# EAGLE design kombi_8relais02 (EAGLE 4.16)
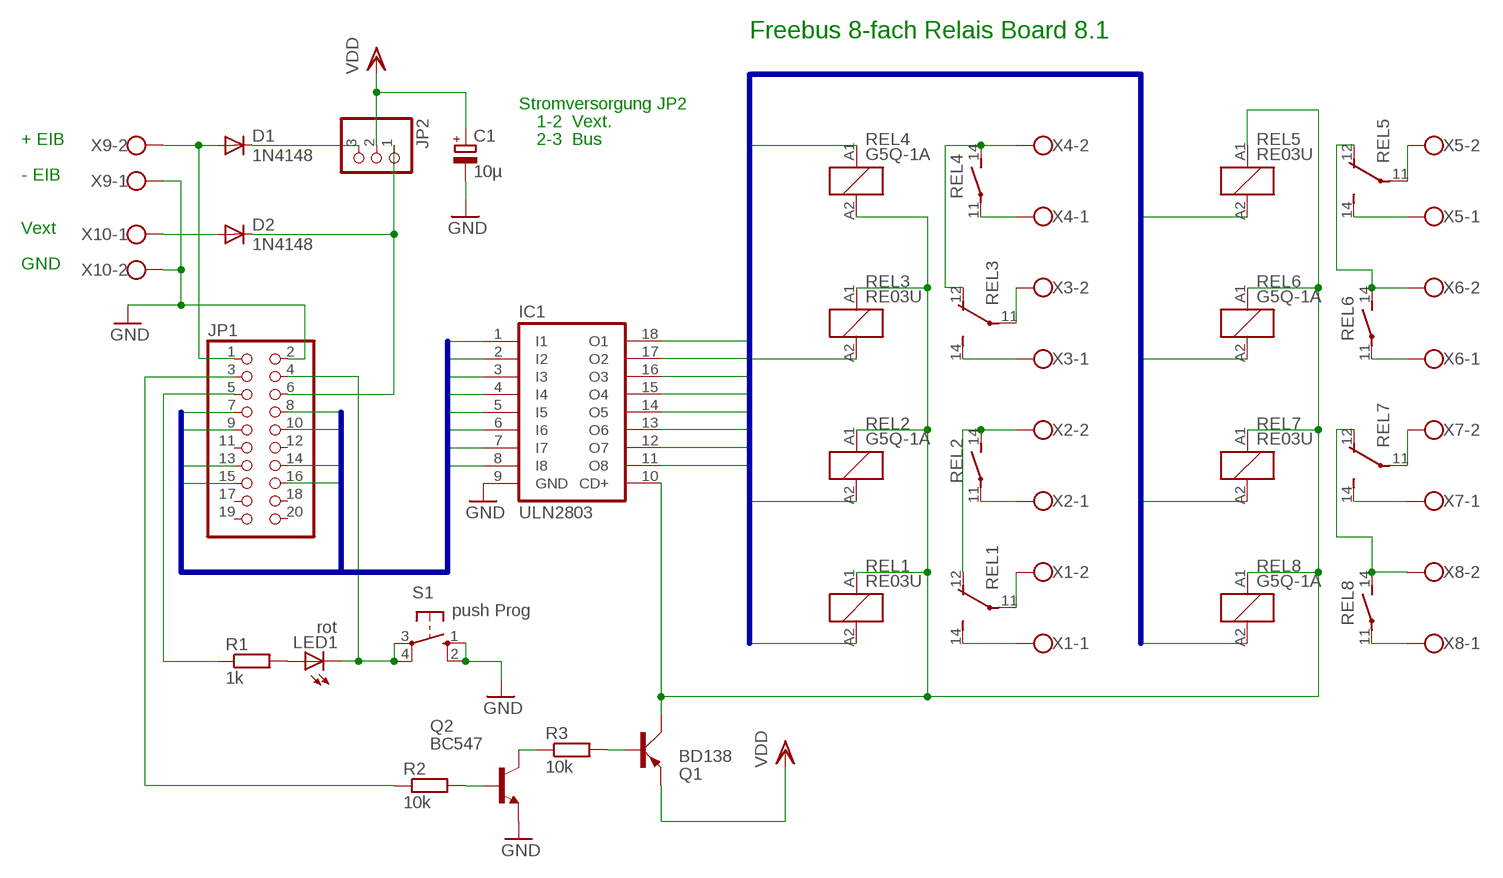
[diagram p0: schematic, sheet 1]

## Parts
C1  10µ  CPOL-EUE3.5-8  [E3,5-8]
D1  1N4148  [DO35-10]
D2  1N4148  [DO35-10]
IC1  ULN2803  ULN2803A  [DIL18]
JP1  PINHD-2X10  [2X10]
JP2  PINHD-1X3  [1X03]
LED1  rot  LED3MM  [LED3MM]
Q1  BD138  BD140  [TO126AV]
Q2  BC547  [TO92]
R1  1k  R-EU_0207/10  [0207/10]
R2  10k  R-EU_0207/10  [0207/10]
R3  10k  R-EU_0207/10  [0207/10]
REL1  RE03U  [G5Q_1_EU]
REL2  G5Q-1A  RE030024  [RE-SCHRACK]
REL3  RE03U  [G5Q_1_EU]
REL4  G5Q-1A  RE030024  [RE-SCHRACK]
REL5  RE03U  [G5Q_1_EU]
REL6  G5Q-1A  RE030024  [RE-SCHRACK]
REL7  RE03U  [G5Q_1_EU]
REL8  G5Q-1A  RE030024  [RE-SCHRACK]
S1  push Prog  10-XX  [B3F-10XX]
X1  W237-102  [W237-102]
X2  W237-102  [W237-102]
X3  W237-102  [W237-102]
X4  W237-102  [W237-102]
X5  W237-102  [W237-102]
X6  W237-102  [W237-102]
X7  W237-102  [W237-102]
X8  W237-102  [W237-102]
X9  W237-102  [W237-102]
X10  W237-102  [W237-102]

## Nets
GND: C1.- IC1.9(GND) JP1.2 Q2.1(E) S1.1(S) S1.2(S1) X9.1 X10.2
IO1: IC1.1(I1) JP1.16
IO2: IC1.2(I2) JP1.15
IO3: IC1.3(I3) JP1.14
IO4: IC1.4(I4) JP1.13
IO5: IC1.5(I5) JP1.10
IO6: IC1.6(I6) JP1.9
IO7: IC1.7(I7) JP1.8
IO8: IC1.8(I8) JP1.7
N$1: REL4.11(2:P) X4.1
N$2: REL3.12(14:O) REL4.14(2:S) X4.2
N$3: REL3.14(14:S) X3.1
N$4: REL3.11(14:P) X3.2
N$5: REL2.11(2:P) X2.1
N$6: REL1.12(14:O) REL2.14(2:S) X2.2
N$7: REL1.14(14:S) X1.1
N$8: REL1.11(14:P) X1.2
N$9: REL5.12(14:O) REL6.14(2:S) X6.2
N$10: REL6.11(2:P) X6.1
N$11: REL7.11(14:P) X7.2
N$12: REL8.11(2:P) X8.1
N$13: REL5.11(14:P) X5.2
N$14: REL5.14(14:S) X5.1
N$15: REL7.14(14:S) X7.1
N$16: REL7.12(14:O) REL8.14(2:S) X8.2
N$17: D2.A X10.1
N$19: IC1.10(CD+) Q1.C REL1.A1 REL2.A1 REL3.A1 REL4.A2 REL5.A1 REL6.A1 REL7.A1 REL8.A1
N$20: D1.A JP1.1 X9.2
N$24: JP1.5 R1.1
N$27: JP1.4 LED1.K(C) S1.3(P) S1.4(P1)
N$28: LED1.A R1.2
N$31: D2.C JP1.6 JP2.1
N$32: D1.C JP2.3
N$33: JP1.3 R2.1
N$37: Q1.B R3.2
N$38: Q2.3(C) R3.1
N$39: Q2.2(B) R2.2
R1: IC1.14(O5) REL4.A1
R2: IC1.13(O6) REL3.A2
R3: IC1.12(O7) REL2.A2
R4: IC1.11(O8) REL1.A2
R5: IC1.15(O4) REL5.A2
R6: IC1.16(O3) REL6.A2
R7: IC1.17(O2) REL7.A2
R8: IC1.18(O1) REL8.A2
VDD: C1.+ JP2.2 Q1.E
Unconnected: JP1.11 JP1.12 JP1.17 JP1.18 JP1.19 JP1.20

## Buses
R[1..8]
IO[1..8]

## Notes on the sheet
- Freebus 8-fach Relais Board 8.1
- Stromversorgung JP2
- 1-2  Vext.
- + EIB | 2-3  Bus
- - EIB
- Vext
- GND

## Library data of the parts
C1 = rcl:CPOL-EU: POLARIZED CAPACITOR, European symbol
D1 D2 = diode:1N4148: DIODE high speed (Philips)
IC1 = uln-udn:ULN2803A: DRIVER ARRAY
JP1 = pinhead:PINHD-2X10: PIN HEADER
JP2 = pinhead:PINHD-1X3: PIN HEADER
LED1 = led:LED: LED OSRAM: - CHIPLED LG R971, LG N971, LY N971, LG Q971, LY Q971, LO R971, LY R971 LH N974, LH R974 LS Q976, LO Q976, LY Q976 LO Q996 - Hyper CHIPLED LW Q18S LB Q993, LB Q99A, LB R99A - SideLED LS A670, LO A670, LY A670, LG A670, LP A670 LB A673, LV A673, LT A673, LW A673 LH A674 LY A675 LS A676, LA A676, LO A676, LY A676, LW A676 LS A679, LY A679, LG A679 - Hyper Micro SIDELED® LS Y876, LA Y876, LO Y876, LY Y876 LT Y87S - SmartLED LW L88C, LW L88S LB L89C, LB L89S, LG L890 LS L89K, LO L89K, LY L89K LS L896, LA L896, LO L896, LY L896 - TOPLED LS T670, LO T670, LY T670, LG T670, LP T670 LSG T670, LSP T670, LSY T670, LOP T670, LYG T670 LG T671, LOG T671, LSG T671 LB T673, LV T673, LT T673, LW T673 LH T674 LS T676, LA T676, LO T676, LY T676, LB T676, LH T676, LSB T676, LW T676 LB T67C, LV T67C, LT T67C, LS T67K, LO T67K, LY T67K, LW E67C LS E67B, LA E67B, LO E67B, LY E67B, LB E67C, LV E67C, LT E67C LW T67C LS T679, LY T679, LG T679 LS T770, LO T770, LY T770, LG T770, LP T770 LB T773, LV T773, LT T773, LW T773 LH T774 LS E675, LA E675, LY E675, LS T675 LS T776, LA T776, LO T776, LY T776, LB T776 LHGB T686 LT T68C, LB T68C - Hyper Mini TOPLED® LB M676 - Mini TOPLED Santana® LG M470 LS M47K, LO M47K, LY M47K Source: http://www.osram.convergy.de - LUMILED® LXK2-PW12-R00, LXK2-PW12-S00, LXK2-PW14-U00, LXK2-PW14-V00 LXK2-PM12-R00, LXK2-PM12-S00, LXK2-PM14-U00 LXK2-PE12-Q00, LXK2-PE12-R00, LXK2-PE12-S00, LXK2-PE14-T00, LXK2-PE14-U00 LXK2-PB12-K00, LXK2-PB12-L00, LXK2-PB12-M00, LXK2-PB14-N00, LXK2-PB14-P00, LXK2-PB14-Q00 LXK2-PR12-L00, LXK2-PR12-M00, LXK2-PR14-Q00, LXK2-PR14-R00 LXK2-PD12-Q00, LXK2-PD12-R00, LXK2-PD12-S00 LXK2-PH12-R00, LXK2-PH12-S00 LXK2-PL12-P00, LXK2-PL12-Q00, LXK2-PL12-R00 Source: www.luxeon.com
Q1 = transistor-power:BD140: PNP TRANSISTOR
Q2 = transistor-npn:BC547*: NPN Transistor
R1-R3 = rcl:R-EU_: RESISTOR, European symbol
REL1 REL3 REL5 REL7 = freebus_relay:RE03U
REL2 REL4 REL6 REL8 = relay:RE03*: Miniature PCB Relay 1 pole 6 A SCHRACK Source: http://www.schrack.com/.. 5812.pdf
S1 = switch-omron:10-XX: OMRON SWITCH
X1-X10 = con-wago-500:W237-102: WAGO SCREW CLAMP

## Board
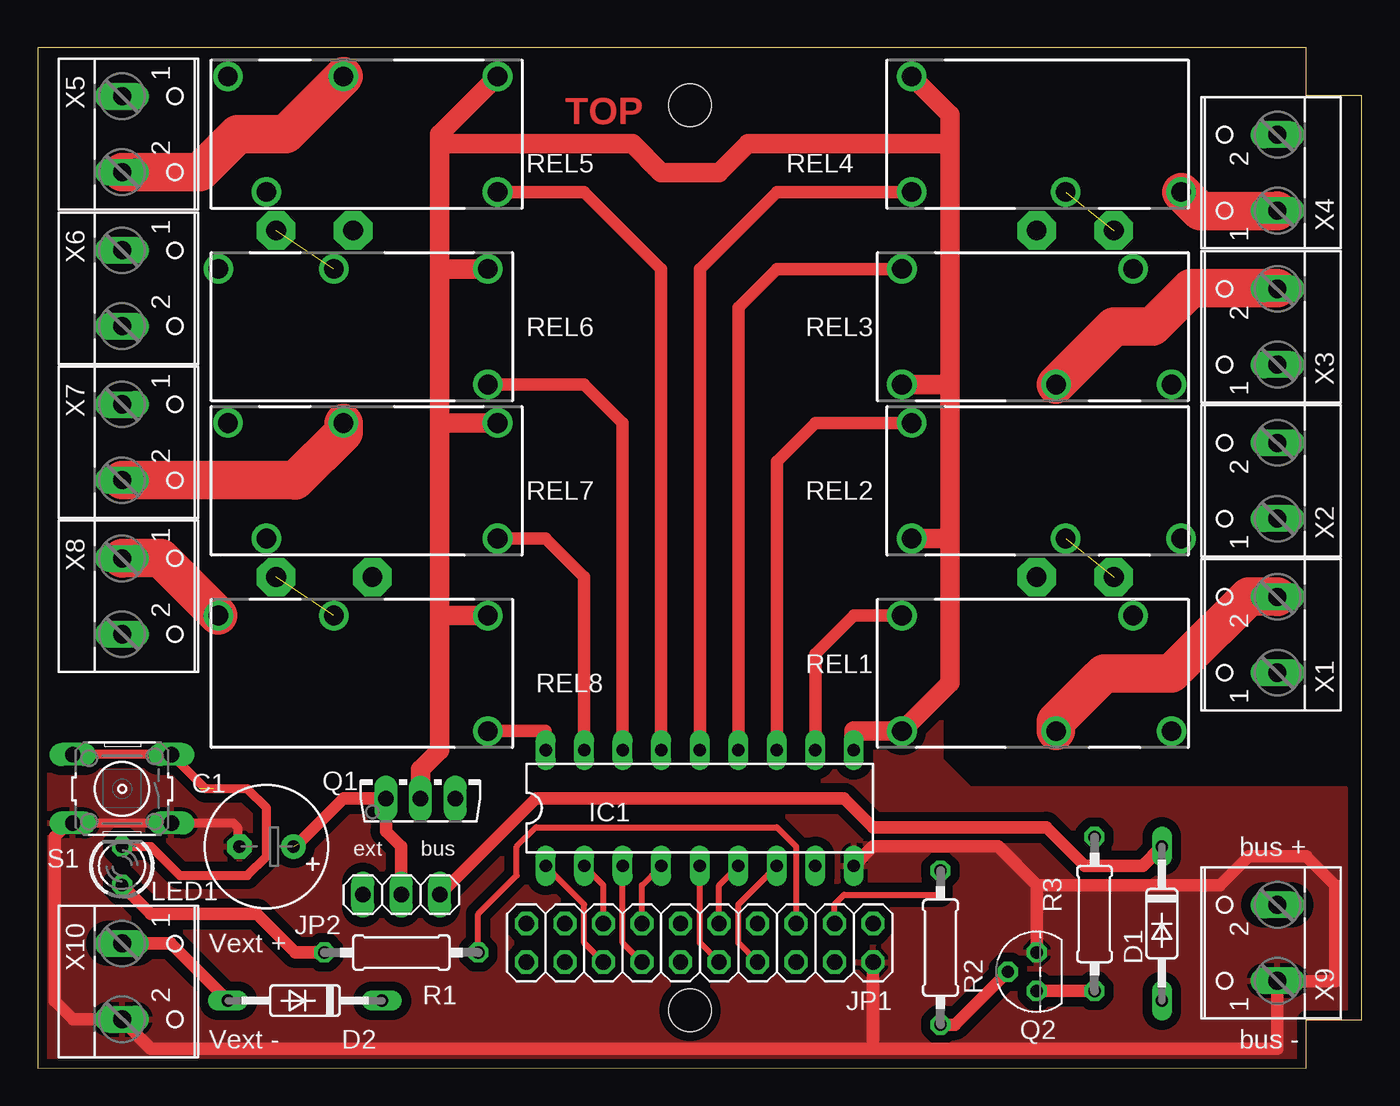
[diagram p1: board, top side]
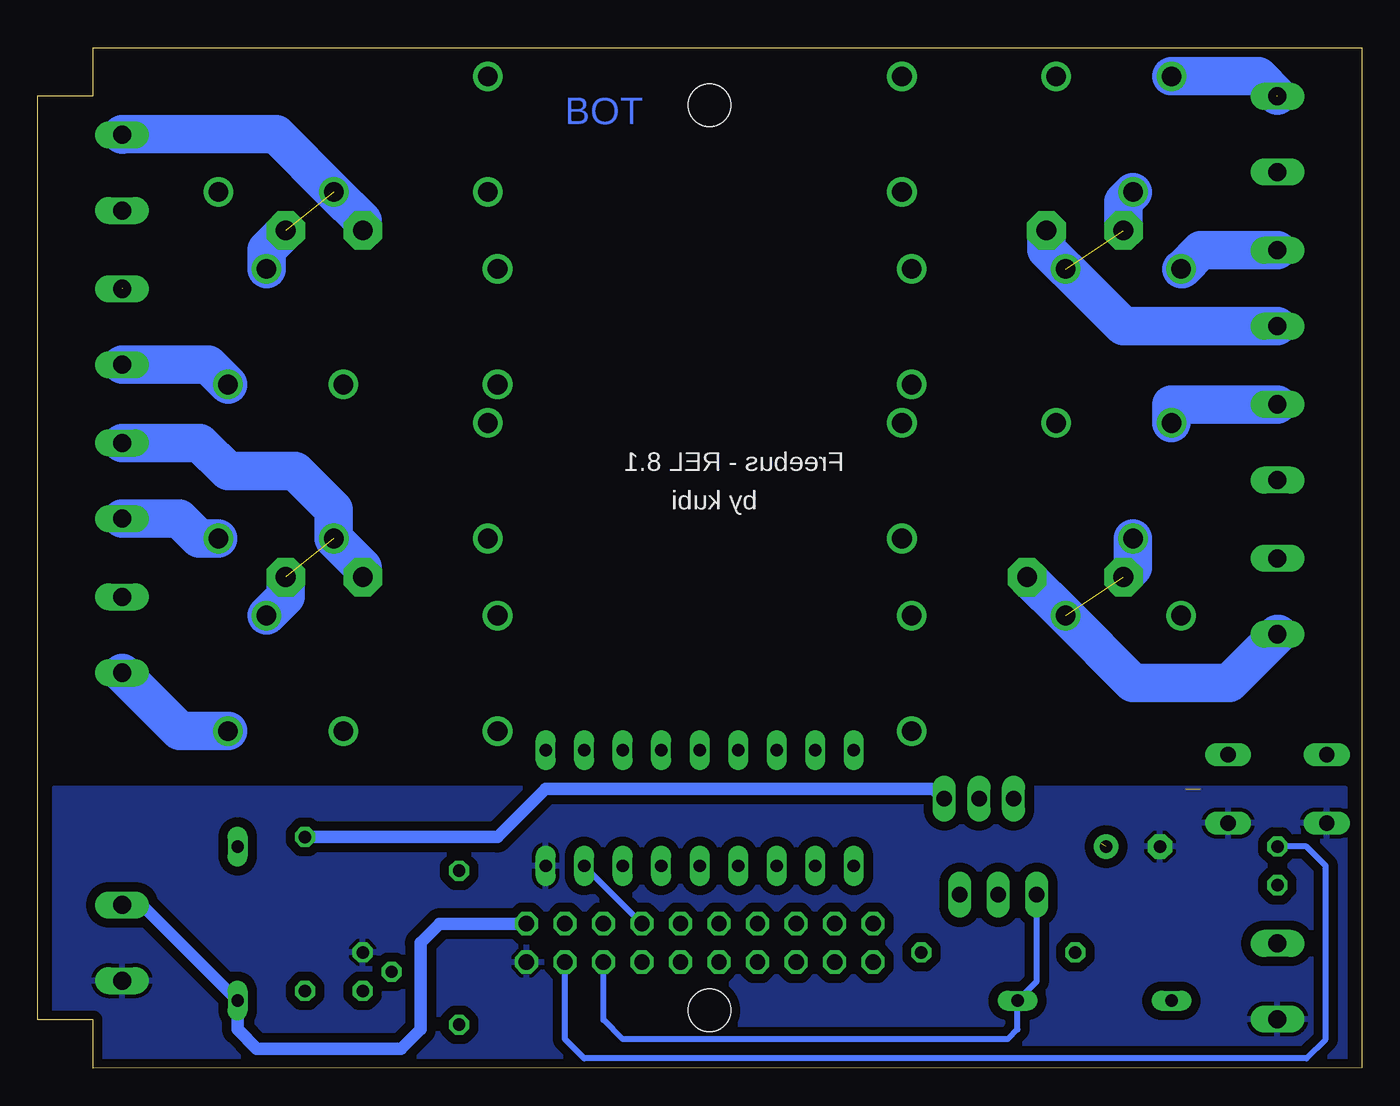
[diagram p2: board, bottom side, seen from below]

Size 87.3 x 67.31 mm. Coordinates in mm from the lower left corner, seen from the top.
Outline: 0,0.01 83.66,0 83.66,3.18 87.3,3.18 87.3,64.13 83.66,64.13 83.66,67.31 0,67.31 0,0.01
Copper layers (1*16): Top 0.035mm / dielectric 1.5mm / Bottom 0.035mm
Design rules "default": minimum track width 10mil, minimum drill 24mil, track to track 16mil, track to pad 12mil, pad to pad 16mil, via to via 16mil, smd to smd 8mil, copper to edge 20mil, drill to drill 10mil, minimum pad ring 10mil, minimum via ring 8mil, stop-mask expansion 4mil, vias tented up to drill 0mil, thermal gap 10mil
Holes 2.8 mm at 43.02,3.81 43.02,63.5

### Footprints (pad centres in the part's own frame; a part is rotated, then mirrored left to right if it is on the bottom)
E3,5-8 = drill 0.813 pad 1.6 round: + -1.778,0 | drill 0.813 pad 1.6 octagon: - 1.778,0
DO35-10 = drill 0.813 long: A 5.08,0; C -5.08,0
DIL18 = drill 0.813 long: 1 -10.16,-3.81; 2 -7.62,-3.81; 3 -5.08,-3.81; 4 -2.54,-3.81; 5 0,-3.81; 6 2.54,-3.81; 7 5.08,-3.81; 8 7.62,-3.81; 9 10.16,-3.81; 10 10.16,3.81; 11 7.62,3.81; 12 5.08,3.81; 13 2.54,3.81; 14 0,3.81; 15 -2.54,3.81; 16 -5.08,3.81; 17 -7.62,3.81; 18 -10.16,3.81
2X10 = drill 1.016 octagon: 1 -11.43,-1.27; 2 -11.43,1.27; 3 -8.89,-1.27; 4 -8.89,1.27; 5 -6.35,-1.27; 6 -6.35,1.27; 7 -3.81,-1.27; 8 -3.81,1.27; 9 -1.27,-1.27; 10 -1.27,1.27; 11 1.27,-1.27; 12 1.27,1.27; 13 3.81,-1.27; 14 3.81,1.27; 15 6.35,-1.27; 16 6.35,1.27; 17 8.89,-1.27; 18 8.89,1.27; 19 11.43,-1.27; 20 11.43,1.27
1X03 = drill 1.016 long: 1 -2.54,0; 2 0,0; 3 2.54,0
LED3MM = drill 0.813 octagon: A -1.27,0; K 1.27,0
TO126AV = drill 1.016 long: B 2.286,-1.27; C 0,-1.27; E -2.286,-1.27
TO92 = drill 0.813 octagon: 1 1.27,0; 2 0,1.905; 3 -1.27,0
0207/10 = drill 0.813 octagon: 1 -5.08,0; 2 5.08,0
G5Q_1_EU = drill 1.3 round: 11 1.27,-3.81; 12 6.35,3.81; 14 8.89,-3.81; A1 -8.89,-3.81; A2 -8.89,3.81
RE-SCHRACK = drill 1.3 round: 11 8.89,-3.81; 14 1.27,-3.81; A1 -8.89,-3.81; A2 -8.89,3.81
B3F-10XX = drill 1.016 long: 1 -3.251,2.261; 2 3.251,2.261; 3 -3.251,-2.261; 4 3.251,-2.261
W237-102 = drill 1.194 long: 1 -2.5,-1.27; 2 2.5,-1.27

### Placement (x,y rotation side)
C1  15.08,14.61 180 top
D1  74.13,9.53 270 top
D2  17.61,4.45 180 top
IC1  43.65,17.15 0 top
JP1  43.65,8.26 180 top
JP2  23.96,11.43 0 top
LED1  5.55,13.33 90 top
Q1  25.23,19.05 0 top
Q2  65.88,6.35 90 top
R1  23.96,7.62 180 top
R2  59.52,7.94 270 top
R3  69.69,10.16 90 top
REL1  65.88,26.04 0 top
REL2  66.51,38.73 0 top
REL3  65.88,48.89 0 top
REL4  66.51,61.59 0 top
REL5  21.42,61.59 180 top
REL6  20.79,48.89 180 top
REL7  21.42,38.73 180 top
REL8  20.79,26.04 180 top
S1  Programmiertaster  [B3F-10XX]  5.55,18.42 180 top
X1  80.48,28.58 90 top
X2  80.48,38.73 90 top
X3  80.48,48.89 90 top
X4  80.48,59.05 90 top
X5  6.82,61.59 270 top
X6  6.82,51.43 270 top
X7  6.82,41.27 270 top
X8  6.82,31.12 270 top
X9  80.48,8.26 90 top
X10  6.82,5.71 270 top

### Tracks (layer width: path | path; a pad name or v marks a point on that pad's centre or on a via)
GND
  Top 0.406: 3.29,16.15 3.01,15.88 2.73,16.15 S1.2
  Top 0.61: 2.02,16.15 S1.2 | 3.29,16.15 S1.1 12.89,16.15 13.17,15.88 13.17,14.73 arc90 C1.- | 81.75,5.71 X9.1
  Top 0.813: 55.08,1.27 7.46,1.27 5.55,3.17 X10.2 2.33,3.21 1.1,4.45 1.1,15.24 2.02,16.15 | 55.08,1.27 81.75,1.27 81.75,5.71 85.56,5.71 85.56,12.06 83.66,13.97 79.84,13.97 77.94,12.06 65.88,12.06 | 65.88,12.06 63.34,14.61 55.71,14.61 55.08,14.61 IC1.9 | 65.88,12.06 Q2.1 | 55.08,1.27 JP1.2
  pour Top (isolate 0.61): 0.47,22.23 27.77,22.23 27.77,24.13 29.04,25.4 55.71,25.4 57.62,25.4 59.52,23.5 59.52,20.32 60.16,19.69 61.43,18.42 62.7,18.42 86.19,18.42 86.19,3.81 83.02,3.81 83.02,0.64 0.47,0.64
  pour Bottom (isolate 0.61): 1.1,0.64 1.1,18.42 86.19,18.42 86.19,3.81 83.02,3.81 83.02,0.64
IO1
  Top 0.406: IC1.1 36.03,10.79 36.03,8.26 JP1.16
IO2
  Top 0.406: JP1.15 37.3,12.06 IC1.2
IO3
  Top 0.406: IC1.3 38.57,8.26 JP1.14
IO4
  Top 0.406: JP1.13 39.84,12.06 IC1.4
IO5
  Top 0.406: IC1.5 43.65,8.26 JP1.10
IO6
  Top 0.406: JP1.9 44.92,12.06 IC1.6
IO7
  Top 0.406: IC1.7 46.19,10.79 46.19,8.26 JP1.8
IO8
  Bottom 0.406: JP1.7 IC1.8
N$1
  Top 2.54: X4.1 81.75,56.52 76.67,56.52 REL4.11
N$2  (via drill 1.3 pad 2.54)  (1 unrouted)
  Bottom 2.54: X4.2 81.75,61.59 71.59,61.59 REL4.14 65.88,55.88 | 65.88,55.88 v65.88,55.24 65.88,55.88 | v70.95,55.24 72.22,53.98 REL3.12
N$3
  Bottom 2.54: X3.1 76.08,46.39 REL3.14
N$4  (1 unrouted)
  Top 2.54: 81.75,51.43 76.03,51.43 73.5,48.89 70.95,48.89 REL3.11
N$5
  Bottom 2.54: X2.1 77.98,36.23 76.67,34.92 REL2.11
N$6  (via drill 1.3 pad 2.54)  (1 unrouted)
  Bottom 2.54: v65.88,32.38 65.88,33.02 REL2.14 67.78,35.56 67.78,36.83 70.32,39.37 72.22,39.37 74.77,39.37 76.63,41.23 X2.2 | v70.95,32.38 70.95,31.12 REL1.12
N$7
  Bottom 2.54: X1.1 81.75,26.04 77.94,22.23 REL1.14
N$8
  Top 2.54: REL1.11 67.14,22.86 69.69,25.4 70.32,26.04 74.77,26.04 75.4,26.67 79.84,31.12 81.75,31.12 X1.2
N$9  (via drill 1.3 pad 2.54)  (1 unrouted)
  Bottom 2.54: X6.2 15.71,48.93 19.48,52.7 REL6.14 20.79,53.98 v20.79,55.24 | REL5.12 15.71,57.15 v15.71,55.24
N$10
  Bottom 2.54: X6.1 10.59,53.93 11.82,52.7 REL6.11
N$11
  Top 2.54: X7.2 16.98,38.77 16.98,38.73 20.15,41.91 REL7.11
N$12
  Top 2.54: X8.1 5.55,33.66 8.09,33.66 REL8.11
N$13
  Top 2.54: X5.2 10.67,59.09 13.17,61.59 16.34,61.59 REL5.11
N$14  (1 unrouted)
  Bottom 2.54: 5.55,64.14 6.82,65.41 REL5.14
N$15
  Bottom 2.54: X7.1 12.54,43.77 REL7.14
N$16  (via drill 1.3 pad 2.54)  (1 unrouted)
  Bottom 2.54: X8.2 5.51,28.62 8.73,25.4 14.44,25.4 15.08,25.4 15.08,25.44 15.12,25.44 REL8.14 v22.06,32.38 | v15.71,32.38 15.08,33.02 REL7.12
N$17
  Top 0.813: X10.1 8.69,8.21 8.77,8.21 D2.A
N$19
  Top 1.27: IC1.10 53.81,22.23 REL1.A1 60.16,25.4 60.16,34.92 | 60.16,45.09 60.16,34.92 | 60.16,34.92 REL2.A1 | 60.16,45.09 REL3.A1 | 60.16,60.96 60.16,45.09 | 60.16,60.96 60.16,61.59 60.16,62.86 REL4.A2 | Q1.C 25.23,19.69 26.5,20.96 26.5,29.85 | 26.5,29.85 REL8.A1 | 26.5,42.54 REL7.A1 | 26.5,29.85 26.5,42.54 | 26.5,52.7 REL6.A1 | REL5.A1 26.5,61.59 26.5,60.96 | 26.5,42.54 26.5,52.7 | 26.5,52.7 26.5,60.96 | 26.5,60.96 39.2,60.96 41.11,59.05 44.92,59.05 46.82,60.96 60.16,60.96
N$20
  Bottom 0.61: 80.44,10.75 X9.2
  Bottom 0.813: 80.44,10.75 D1.A 74.13,2.54 72.86,1.27 63.34,1.27 62.06,2.54 62.06,8.26 60.8,9.53 JP1.1
N$24
  Top 0.406: JP1.5 50,14.61 48.73,15.88 32.85,15.88 31.58,14.61 31.58,12.7 29.04,10.16 R1.1
N$27  (1 unrouted)
  Top 0.406: 8.73,20.75 arc90 S1.3
  Top 0.61: LED1.K 7.46,14.61 9.36,12.7 13.81,12.7 15.08,13.97 15.08,17.15 13.81,18.42 11.58,18.42 11.06,18.42 8.73,20.75 | S1.4 8.09,20.68 S1.3
  Bottom 0.406: JP1.4 52.54,1.91 51.27,0.64 3.64,0.64 2.38,1.91 2.38,13.33 3.64,14.61 LED1.K
N$28
  Top 0.813: LED1.A 7.46,10.16 14.44,10.16 16.98,7.62 R1.2
N$31
  Bottom 0.406: JP1.6 50,3.17 48.73,1.91 23.33,1.91 22.7,2.54 D2.C 21.42,5.71 JP2.1
N$32
  Top 0.813: D1.C 72.86,13.33 69.05,13.33 66.51,15.88 55.08,15.88 53.17,17.78 32.85,17.78 JP2.3
N$33
  Top 0.406: JP1.3 52.54,10.79 53.17,11.43 59.52,11.43 R2.1
N$37
  Bottom 0.61: Q1.B 27.46,17.78 27.77,17.78 28.41,18.42
  Bottom 0.813: R3.2 56.98,15.24 53.81,18.42 28.41,18.42
N$38
  Top 0.813: Q2.3 R3.1
N$39
  Top 0.813: Q2.2 60.48,2.86 R2.2
R1
  Top 0.813: IC1.14 43.65,52.7 48.73,57.78 REL4.A1
R2
  Top 0.813: IC1.13 46.19,50.16 48.73,52.7 REL3.A2
R3
  Top 0.813: IC1.12 48.73,40 51.27,42.54 REL2.A2
R4
  Top 0.813: IC1.11 51.27,27.31 53.81,29.85 REL1.A2
R5
  Top 0.813: IC1.15 41.11,52.7 36.03,57.78 REL5.A2
R6
  Top 0.813: IC1.16 38.57,42.54 36.03,45.09 REL6.A2
R7
  Top 0.813: IC1.17 36.03,32.38 33.49,34.92 REL7.A2
R8
  Top 0.813: IC1.18 33.49,22.23 REL8.A2
VDD  (1 unrouted)
  Top 0.813: 17.17,14.8 20.15,17.78 Q1.E 22.95,15.62 23.96,14.61 JP2.2

### Text on the board
Top: TOP
Bottom: BOT
tPlace: ext | bus | bus + | Vext + | Vext - | bus -
bPlace: Freebus - REL 8.1 | by kubi